# EAGLE design detector328p-au (EAGLE 7.1.0)

## Sheet 1 of 2
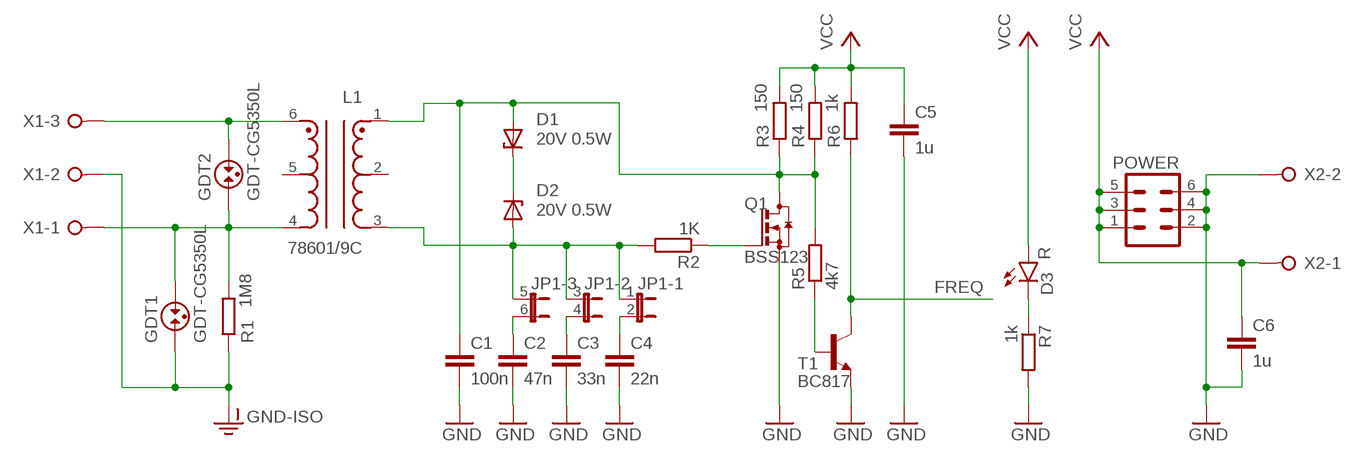
[diagram p0: schematic, sheet 1]

### Parts
C1  100n  C-EUC1206  [C1206]
C2  47n  C-EUC0805  [C0805]
C3  33n  C-EUC0805  [C0805]
C4  22n  C-EUC0805  [C0805]
C5  1u  C-EUC0603  [C0603]
C6  1u  C-EUC0603  [C0603]
D1  20V 0.5W  ZENER-DIODESOD80C  [SOD80C]
D2  20V 0.5W  ZENER-DIODESOD80C  [SOD80C]
D3  R  LED0603  [LED-0603]
GDT1  GDT-CG5350L  [CG5350L]
GDT2  GDT-CG5350L  [CG5350L]
JP1  JP3QE  [JP3Q]
L1  78601/9C  [78601/9C]
POWER  MA03-2  [MA03-2]
Q1  BSS123  [SOT23]
R1  1M8  R-EU_R0603  [R0603]
R2  1K  R-EU_R0603  [R0603]
R3  150  R-EU_R0603  [R0603]
R4  150  R-EU_R0603  [R0603]
R5  4k7  R-EU_R0603  [R0603]
R6  1k  R-EU_R0603  [R0603]
R7  1k  R-EU_R0603  [R0603]
T1  BC817  BC817-40SMD  [SOT23-BEC]
X1  W237-3E  [W237-3E]
X2  W237-02P  [W237-132]

### Nets
FREQ: R6.1 T1.C ; also sheet 2
GND: C1.2 C2.2 C3.2 C4.2 C5.2 C6.2 POWER.2 POWER.4 POWER.6 Q1.2(S) R7.2 T1.E X2.2 ; also sheet 2
GND-ISO: GDT1.1 R1.1 X1.2
N$1: D1.C D2.C
N$2: R5.1 T1.B
N$3: Q1.1(G) R2.1
N$4: C3.1 JP1.4
N$5: C4.1 JP1.2
N$6: D2.A JP1.1 JP1.3 JP1.5 L1.3 R2.2
N$7: GDT2.2 L1.6 X1.3
N$11: C2.1 JP1.6
N$14: C1.1 D1.A L1.1 Q1.3(D) R3.1 R4.1 R5.2
N$21: GDT1.2 GDT2.1 L1.4 R1.2 X1.1
N$22: D3.C R7.1
VCC: C5.1 C6.1 D3.A POWER.1 POWER.3 POWER.5 R3.2 R4.2 R6.2 X2.1 ; also sheet 2
Unconnected: L1.2 L1.5

## Sheet 2 of 2
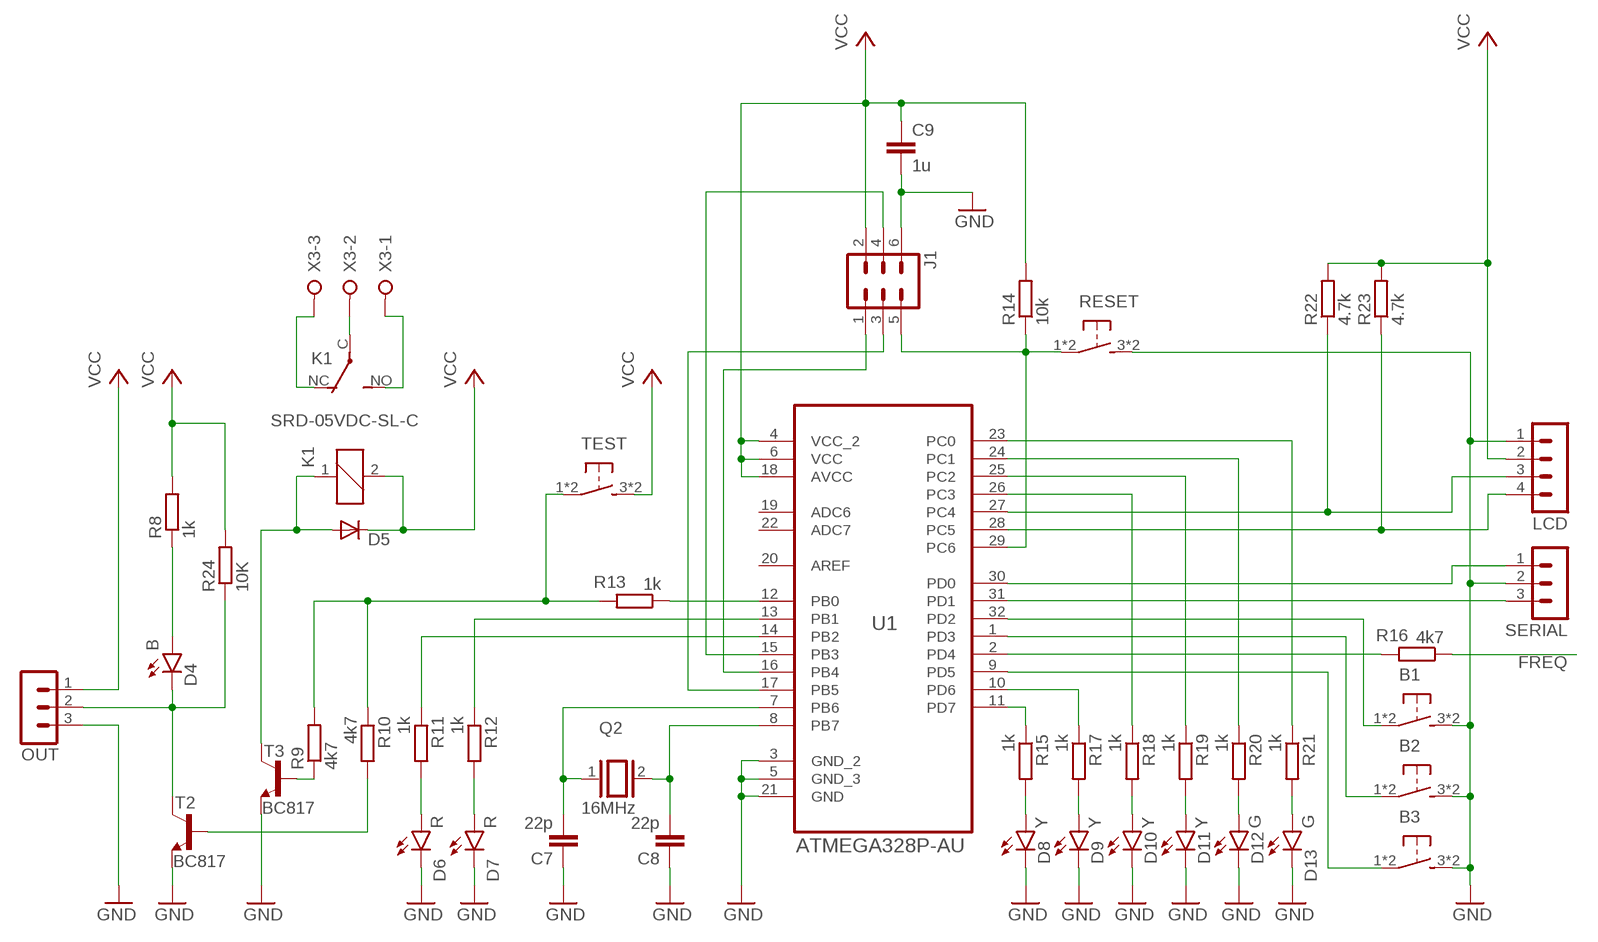
[diagram p1: schematic, sheet 2]

### Parts
B1  10-XX  [B3F-10XX]
B2  10-XX  [B3F-10XX]
B3  10-XX  [B3F-10XX]
C7  22p  C-EUC0603  [C0603]
C8  22p  C-EUC0603  [C0603]
C9  1u  C-EUC0603  [C0603]
D4  B  LED0603  [LED-0603]
D5  DIODE-SOD80C  [SOD80C]
D6  R  LED0603  [LED-0603]
D7  R  LED0603  [LED-0603]
D8  Y  LED0603  [LED-0603]
D9  Y  LED0603  [LED-0603]
D10  Y  LED0603  [LED-0603]
D11  Y  LED0603  [LED-0603]
D12  G  LED0603  [LED-0603]
D13  G  LED0603  [LED-0603]
J1  MA03-2  [MA03-2]
K1  SRD-05VDC-SL-C  [JS-M]
LCD  MA04-1  [MA04-1]
OUT  MA03-1  [MA03-1]
Q2  16MHz  XTAL/S  [QS]
R8  1k  R-EU_R0603  [R0603]
R9  4k7  R-EU_R0603  [R0603]
R10  4k7  R-EU_R0603  [R0603]
R11  1k  R-EU_R0603  [R0603]
R12  1k  R-EU_R0603  [R0603]
R13  1k  R-EU_R0603  [R0603]
R14  10k  R-EU_R0603  [R0603]
R15  1k  R-EU_R0603  [R0603]
R16  4k7  R-EU_R0603  [R0603]
R17  1k  R-EU_R0603  [R0603]
R18  1k  R-EU_R0603  [R0603]
R19  1k  R-EU_R0603  [R0603]
R20  1k  R-EU_R0603  [R0603]
R21  1k  R-EU_R0603  [R0603]
R22  4.7k  R-EU_R0603  [R0603]
R23  4.7k  R-EU_R0603  [R0603]
R24  10K  R-EU_R0603  [R0603]
RESET  10-XX  [B3F-10XX]
SERIAL  MA03-1  [MA03-1]
T2  BC817  BC817-40SMD  [SOT23-BEC]
T3  BC817  BC817-40SMD  [SOT23-BEC]
TEST  10-XX  [B3F-10XX]
U1  ATMEGA328P-AU  [QFP80P900X900X120-32N]
X3  W237-3E  [W237-3E]

### Nets
FREQ: R16.1 ; also sheet 1
GND: B1.3(S) B1.4(S) B2.3(S) B2.4(S) B3.3(S) B3.4(S) C7.1 C8.1 C9.2 D6.C D7.C D8.C D9.C D10.C D11.C D12.C D13.C J1.6 LCD.1 OUT.3 RESET.3(S) RESET.4(S) SERIAL.2 T2.E T3.E U1.3(GND_2) U1.5(GND_3) U1.21(GND) ; also sheet 1
N$8: C7.2 Q2.1 U1.7(PB6)
N$9: R16.2 U1.2(PD4)
N$10: C8.2 Q2.2 U1.8(PB7)
N$12: J1.1 U1.16(PB4)
N$13: J1.4 U1.15(PB3)
N$15: J1.3 U1.17(PB5)
N$16: D9.A R17.2
N$17: D10.A R18.2
N$18: D11.A R19.2
N$19: D12.A R20.2
N$20: R10.2 T2.B
N$23: D4.C OUT.2 R24.1 T2.C
N$24: D4.A R8.1
N$25: R17.1 U1.10(PD6)
N$26: R15.1 U1.11(PD7)
N$27: D8.A R15.2
N$28: R18.1 U1.26(PC3)
N$29: R19.1 U1.25(PC2)
N$30: J1.5 R14.1 RESET.1(P) RESET.2(P) U1.29(PC6)
N$31: R20.1 U1.24(PC1)
N$32: D13.A R21.2
N$33: R21.1 U1.23(PC0)
N$34: D7.A R12.2
N$35: D6.A R11.2
N$36: R11.1 U1.14(PB2)
N$37: R12.1 U1.13(PB1)
N$38: D5.A K1.1 T3.C
N$39: SERIAL.1 U1.30(PD0)
N$40: R9.1 T3.B
N$41: K1.NC(2:O) X3.3
N$42: K1.NO(2:S) X3.1
N$43: K1.C(2:P) X3.2
N$44: LCD.4 R23.1 U1.28(PC5)
N$45: LCD.3 R22.1 U1.27(PC4)
N$46: R13.1 U1.12(PB0)
N$47: R9.2 R10.1 R13.2 TEST.1(P) TEST.2(P)
N$48: SERIAL.3 U1.31(PD1)
N$49: B1.1(P) B1.2(P) U1.32(PD2)
N$50: B2.1(P) B2.2(P) U1.1(PD3)
N$51: B3.1(P) B3.2(P) U1.9(PD5)
VCC: C9.1 D5.C J1.2 K1.2 LCD.2 OUT.1 R8.2 R14.2 R22.2 R23.2 R24.2 TEST.3(S) TEST.4(S) U1.4(VCC_2) U1.6(VCC) U1.18(AVCC) ; also sheet 1
Unconnected: U1.19(ADC6) U1.20(AREF) U1.22(ADC7)

## Library data of the parts
B1-B3 RESET TEST = detector:10-XX: OMRON SWITCH; MPN: B3F-1000; OC_FARNELL: 176432; OC_NEWARK: 36M3542
C1-C4 C7 C8 = resistor:C-EU: CAPACITOR, European symbol
C5 C6 C9 = rcl:C-EU: CAPACITOR, European symbol
D1 D2 = diode:ZENER-DIODE: Z-Diode
D3 D4 D6-D13 = SparkFun-LED:LED: LEDs Standard schematic elements and footprints for 5mm, 3mm, 1206, and 0603 sized LEDs. 5mm - Spark Fun Electronics SKU : COM-00529 (and others)
D5 = diode:DIODE-: DIODE
GDT1 GDT2 = supressor:GDT-: GAS DISCHARGE TUBE
J1 POWER = con-lstb:MA03-2: PIN HEADER; OC_FARNELL: unknown; OC_NEWARK: unknown
JP1 = detector:JP3QE: JUMPER
K1 = detector:SRD-*-SL-C: Ultra-Miniature Power Relay
L1 = detector:78601/9C: MuRata 78601/9C
LCD = con-lstb:MA04-1: PIN HEADER; OC_FARNELL: unknown; OC_NEWARK: unknown
OUT SERIAL = con-lstb:MA03-1: PIN HEADER; OC_FARNELL: unknown; OC_NEWARK: unknown
Q1 = transistor-small-signal:BSS123: N-CHANNEL MOS FET
Q2 = special:XTAL/S: CRYSTAL
R1-R21 R24 = resistor:R-EU_: RESISTOR, European symbol
R22 R23 = rcl:R-EU_: RESISTOR, European symbol
T1-T3 = transistor-npn:BC817*: NPN Transistor
U1 = detector:ATMEGA328P-AU: 8-bit Microcontroller with In-System Programmable Flash; MPN: ATMEGA328P-AU; OC_FARNELL: 1715486; OC_NEWARK: 14R4631; PACKAGE: TQFP-32; SUPPLIER: Atmel
X1 X3 = detector:W237-3E: WAGO SREW CLAMP; OC_FARNELL: unknown; OC_NEWARK: unknown
X2 = detector:W237-02P: WAGO SREW CLAMP; OC_FARNELL: unknown; OC_NEWARK: unknown

## Board
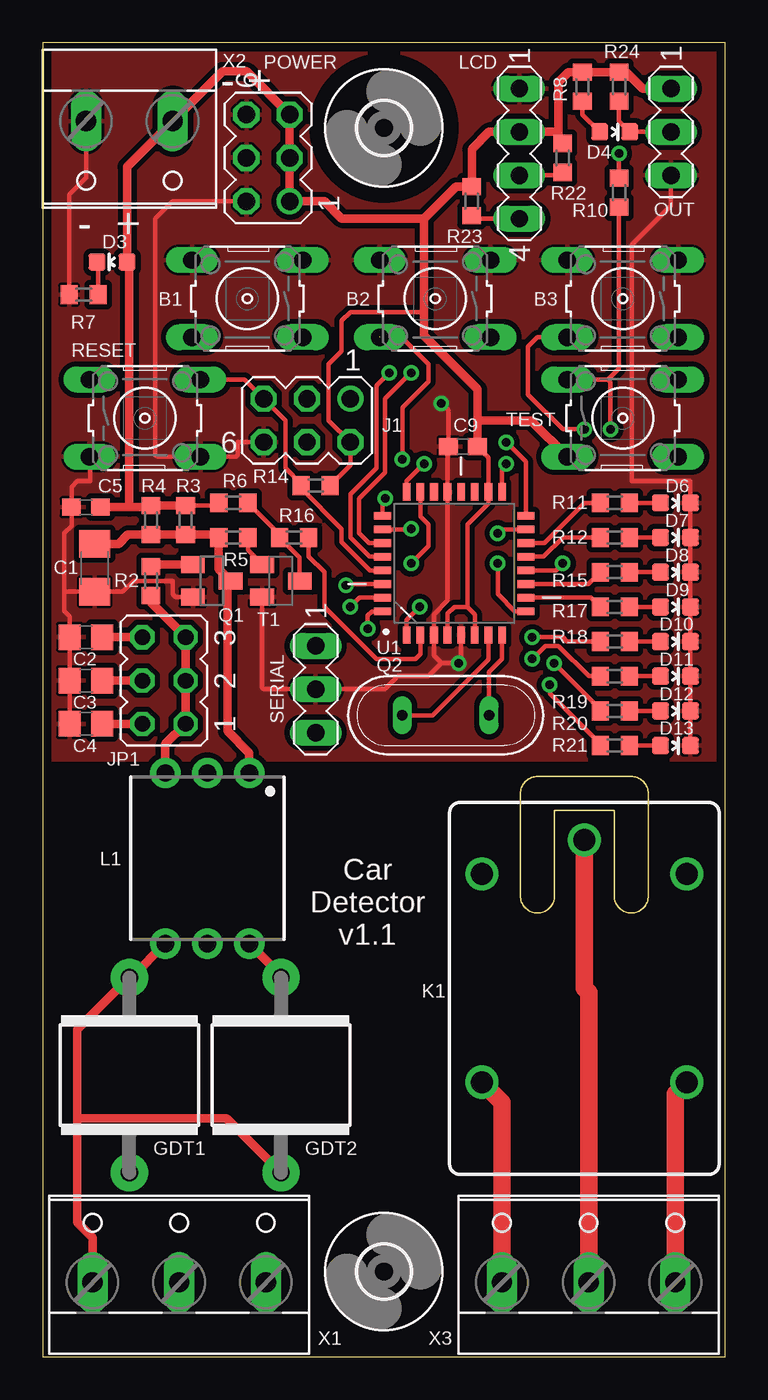
[diagram p2: board, top side]
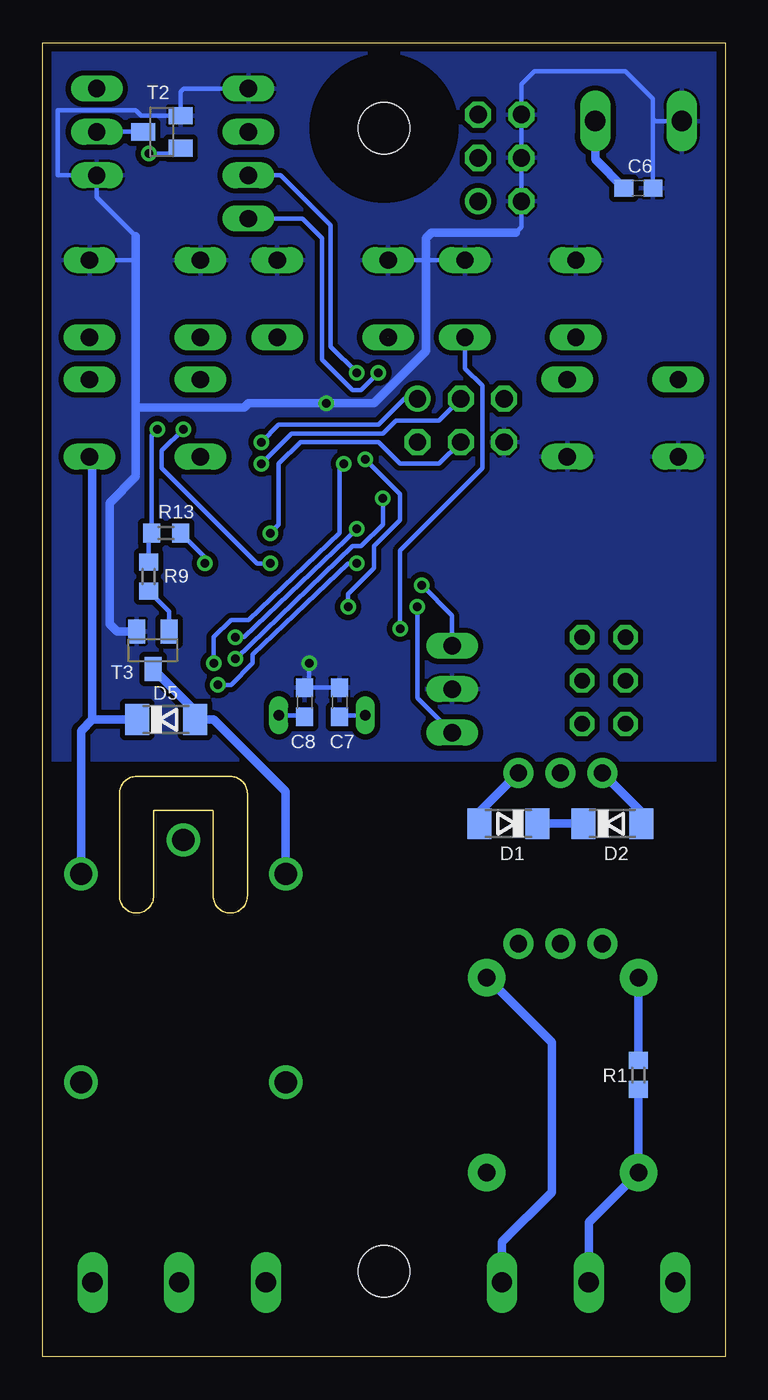
[diagram p3: board, bottom side, seen from below]

Size 40 x 77 mm. Coordinates in mm from the lower left corner, seen from the top.
Outline: 0,0 40,0 40,77 0,77 0,0
Copper layers (1*16): Top 0.035mm / dielectric 1.5mm / Bottom 0.035mm
Design rules "NYAKARUHAZ_StandardNYAK": minimum track width 6mil, minimum drill 12mil, track to track 6mil, track to pad 6mil, pad to pad 6mil, via to via 6mil, smd to smd 6mil, copper to edge 20mil, drill to drill 8mil, minimum pad ring 10mil, minimum via ring 8mil, stop-mask expansion 4mil, vias tented up to drill 0mil, thermal gap 6mil
Milling: 12 lines

### Footprints (pad centres in the part's own frame; a part is rotated, then mirrored left to right if it is on the bottom)
B3F-10XX = drill 1.016 long: 1 -3.251,2.261; 2 3.251,2.261; 3 -3.251,-2.261; 4 3.251,-2.261
C1206 = smd 1.6 x 1.8: 1 -1.4,0; 2 1.4,0
C0805 = smd 1.3 x 1.5: 1 -0.95,0; 2 0.95,0
C0603 = smd 1.1 x 1: 1 -0.85,0; 2 0.85,0
SOD80C = smd 1.4 x 1.8: A 1.7,0; C -1.7,0
LED-0603 = smd 1 x 1: A 0,-0.877; C 0,0.877
CG5350L = drill 1.016 pad 2.184: 1 -5.715,0; 2 5.715,0
MA03-2 = drill 1.016: 1 -2.54,-1.27 | drill 1.016 octagon: 2 -2.54,1.27; 3 0,-1.27; 4 0,1.27; 5 2.54,-1.27; 6 2.54,1.27
JP3Q = drill 0.914 octagon: 1 -2.54,-1.27; 2 -2.54,1.27; 3 0,-1.27; 4 0,1.27; 5 2.54,-1.27; 6 2.54,1.27
JS-M = drill 1.3: 1 6.7,6; 2 6.7,-6; C 8.7,0; NC -5.5,-6; NO -5.5,6
78601/9C = drill 1 pad 1.778: 1 -5,2.46; 2 -5,0; 3 -5,-2.46; 4 5,-2.46; 5 5,0; 6 5,2.46
MA04-1 = drill 1.016 long: 1 -3.81,0; 2 -1.27,0; 3 1.27,0; 4 3.81,0
MA03-1 = drill 1.016 long: 1 -2.54,0; 2 0,0; 3 2.54,0
SOT23 = smd 1 x 1.4: 1 -0.95,-1.1; 2 0.95,-1.1; 3 0,1.1
QS = drill 0.61 long: 1 -2.54,0; 2 2.54,0
R0603 = smd 1 x 1.1: 1 -0.85,0; 2 0.85,0
SOT23-BEC = smd 1 x 1.4: B -0.95,-1.1; C 0,1.1; E 0.95,-1.1
QFP80P900X900X120-32N = smd 1 x 0.45: 1 -4.2,2.8; 2 -4.2,2; 3 -4.2,1.2; 4 -4.2,0.4; 5 -4.2,-0.4; 6 -4.2,-1.2; 7 -4.2,-2; 8 -4.2,-2.8; 17 4.2,-2.8; 18 4.2,-2; 19 4.2,-1.2; 20 4.2,-0.4; 21 4.2,0.4; 22 4.2,1.2; 23 4.2,2; 24 4.2,2.8 | smd 0.45 x 1: 9 -2.8,-4.2; 10 -2,-4.2; 11 -1.2,-4.2; 12 -0.4,-4.2; 13 0.4,-4.2; 14 1.2,-4.2; 15 2,-4.2; 16 2.8,-4.2; 25 2.8,4.2; 26 2,4.2; 27 1.2,4.2; 28 0.4,4.2; 29 -0.4,4.2; 30 -1.2,4.2; 31 -2,4.2; 32 -2.8,4.2
3,0 = hole 3: 0,0
W237-3E = drill 1.194 long: 1 -5.08,-0.635; 2 0,-0.635; 3 5.08,-0.635
W237-132 = drill 1.194 long: 1 -2.54,-0.635; 2 2.54,-0.635

### Placement (x,y rotation side)
B1  12,62 180 top
B2  23,62 180 top
B3  34,62 180 top
C1  3.05,46.23 270 top
C2  2.54,42.16 180 top
C3  2.54,39.62 180 top
C4  2.54,37.08 180 top
C5  2.54,49.78 180 top
C6  5.08,68.47 0 bottom
C7  22.61,38.35 270 bottom
C8  24.64,38.35 270 bottom
C9  24.64,53.34 180 top
D1  12.7,31.24 180 bottom
D2  6.6,31.24 0 bottom
D3  4.06,64.15 90 top
D4  33.53,71.77 270 top
D5  32.77,37.34 0 bottom
D6  37.08,50.04 270 top
D7  37.08,48.01 270 top
D8  37.08,45.97 270 top
D9  37.08,43.94 270 top
D10  37.08,41.91 270 top
D11  37.08,39.88 270 top
D12  37.08,37.85 270 top
D13  37.08,35.81 270 top
GDT1  5.08,16.51 90 top
GDT2  13.97,16.51 90 top
J1  15.49,54.86 180 top
JP1  7.11,39.62 90 top
K1  31.75,21.59 90 top
L1  9.65,29.21 270 top
LCD  27.94,70.5 270 top
OUT  36.83,71.77 270 top
POWER  13.21,70.25 90 top
Q1  9.91,45.47 270 top
Q2  23.62,37.59 0 top
R1  5.08,16.51 90 bottom
R2  6.35,45.47 270 top
R3  8.38,49.02 90 top
R4  6.35,49.02 90 top
R5  11.18,48.01 180 top
R6  11.18,50.04 180 top
R7  2.4,62.23 180 top
R8  31.64,74.42 90 top
R9  33.78,45.72 90 bottom
R10  33.78,68.21 90 top
R11  33.53,50.04 0 top
R12  33.53,48.01 0 top
R13  32.77,48.26 180 bottom
R14  16,51.05 0 top
R15  33.53,45.97 0 top
R16  14.73,48.01 0 top
R17  33.53,43.94 0 top
R18  33.53,41.91 0 top
R19  33.53,39.88 0 top
R20  33.53,37.85 0 top
R21  33.53,35.81 0 top
R22  30.48,70.25 90 top
R23  25.15,67.71 90 top
R24  33.78,74.42 90 top
RESET  6,55 0 top
SERIAL  16,39.12 270 top
T1  13.97,45.47 270 top
T2  33.02,71.77 90 bottom
T3  33.53,41.4 180 bottom
TEST  34,55 0 top
U1  24.13,46.48 90 top
U$1  [3,0]  20,5 0 top
U$2  [3,0]  20,72 0 top
X1  8,5 0 top
X2  5.08,71.77 180 top
X3  32,5 0 top

### Tracks (layer width: path | path; a pad name or v marks a point on that pad's centre or on a via)
FREQ
  Top 0.254: R6.1 13.88,48.18 R16.1 15.07,46.82 T1.C
GND  (via drill 0.5)
  Top 0.254: C4.2 C3.2 C2.2 1.59,43.37 1.27,43.69 1.27,44.7 | Q1.2 7.81,44.52 7.62,44.7 7.62,45.47 5.33,45.47 4.7,44.83 C1.2 1.39,44.83 1.27,44.7 | J1.6 11.43,53.59 11.43,52.83 11.34,52.74 RESET.4 6.7,52.74 6.6,52.83 6.6,66.69 7.62,67.71 POWER.2 | 23.37,40.64 22.93,41.08 U1.3 22.93,43.5 23.73,44.3 U1.21 23.73,53.28 C9.2 | 23.37,40.64 v24.38,40.64 24.53,40.79 U1.5 | C9.2 23.72,53.02 | OUT.3 36.83,67.45 34.54,65.17 34.54,51.31 37.96,51.31 D6.C D7.C D8.C D9.C D10.C D11.C D12.C D13.C | RESET.3 2.79,52.69 2.79,51.31 2.03,51.31 1.69,50.97 C5.2 1.69,48.68 1.27,48.26 1.27,44.7 | v23.37,55.88 23.79,55.46 C9.2 | 23.37,40.64 22.61,39.88 20.83,39.88 20.07,39.12 SERIAL.2 12.95,39.12 12.87,39.2 T1.E | X2.2 2.54,69.09 1.55,68.1 R7.2
  Bottom 0.254: C6.2 4.23,72.53 | 4.23,72.53 4.23,73.71 5.84,75.33 11.18,75.33 11.94,74.56 POWER.6 POWER.4 POWER.2 11.94,66.18 12.26,65.86 | X2.2 4.1,72.41 4.23,72.53 | C7.1 C8.1 24.38,39.71 v24.38,40.64 | LCD.1 31.75,74.31 31.92,74.14 T2.E 34.22,72.72 34.54,73.04 39.12,73.04 39.12,69.23 OUT.3 36.83,67.96 34.54,65.67 | B1.3 17.53,64.26 B2.4 | B3.3 34.54,64.26
  Bottom 0.508: T3.E 35.64,42.5 36.07,42.93 36.07,50.04 34.54,51.56 34.54,55.63 | 34.54,55.63 34.54,64.26 34.54,65.67 | 34.54,55.63 28.19,55.63 27.94,55.88 v23.37,55.88 20.57,55.88 17.53,58.93 17.53,64.26 17.53,65.53 17.2,65.86 12.26,65.86
  pour Bottom (isolate 0.305): 0,77 40,77 40,35 0,35
  pour Top (isolate 0.305): 40,77 0,77 0,35 40,35
GND-ISO
  Bottom 0.508: R1.1 GDT1.1 8,7.88 X1.2
N$1
  Bottom 0.508: D2.C D1.C
N$2
  Top 0.254: R5.1 12.03,47.26 T1.B
N$3
  Top 0.254: 6.45,46.42 R2.1
  Top 0.508: Q1.1 6.45,46.42
N$4
  Top 0.508: JP1.4 C3.1
N$5
  Top 0.508: JP1.2 C4.1
N$6
  Top 0.254: R2.2 6.35,44.2
  Top 0.508: 6.35,44.2 JP1.5 JP1.3 JP1.1 7.19,35.89 L1.3
  Bottom 0.508: D2.A 4.9,31.92 L1.3
N$7
  Top 0.254: GDT2.2 13.97,22.35
  Top 0.508: 13.97,22.35 L1.6
  Bottom 0.508: X1.3 13.08,6.73 10.16,9.65 10.16,18.41 GDT2.2
N$8
  Top 0.254: U1.7 26.13,40.86 22.86,37.59 Q2.1
  Bottom 0.254: C7.2 22.52,37.59 Q2.1
N$9
  Top 0.254: U1.2 22.13,41.18 21.84,40.89 19.56,40.89 16.51,43.94 16.51,45.97 15.58,46.9 R16.2
N$10
  Top 0.254: U1.8 26.93,40.9 26.16,40.13 Q2.2
  Bottom 0.254: C8.2 24.73,37.59 Q2.2
N$11
  Top 0.508: JP1.6 C2.1
N$12  (via drill 0.5)
  Top 0.254: U1.16 28.33,52.44 v27.18,53.59
  Bottom 0.254: v27.18,53.59 26.16,54.61 20.32,54.61 18.8,56.13 J1.1
N$13  (via drill 0.5)
  Top 0.254: U1.15 26.89,48.48 v26.67,48.26
  Bottom 0.254: J1.4 16.76,52.32 19.05,52.32 20.32,53.59 24.89,53.59 26.16,52.32 26.16,48.77 v26.67,48.26
N$14
  Top 0.254: 10.83,45.29 Q1.3 10.92,45.55
  Top 0.508: L1.1 12.11,35.39 10.83,36.66 10.83,45.29 | Q1.3 10.33,46.15 R5.2 10.16,48.17 R3.1 R4.1 4.99,48.17 4.45,47.63 C1.1
  Bottom 0.508: D1.A 14.4,31.92 L1.1
N$15  (via drill 0.5)
  Top 0.254: U1.17 26.93,52.08 v27.18,52.32
  Bottom 0.254: v27.18,52.32 25.4,54.1 20.07,54.1 19.3,54.86 16.76,54.86 J1.3
N$16
  Top 0.254: R17.2 D9.A
N$17
  Top 0.254: R18.2 D10.A
N$18
  Top 0.254: R19.2 D11.A
N$19
  Top 0.254: R20.2 D12.A
N$20  (via drill 0.5)
  Top 0.254: R10.2 v33.78,70.5
  Bottom 0.254: v33.78,70.5 32.24,70.5 T2.B
N$21
  Top 0.254: GDT1.2 5.21,22.23
  Top 0.508: 5.21,22.23 L1.4 | X1.1 2.92,6.99 2.03,7.87 2.03,13.97 | 2.03,13.97 2.03,19.18 GDT1.2 | GDT2.1 10.79,13.97 2.03,13.97
  Bottom 0.508: R1.2 GDT1.2
N$22
  Top 0.254: R7.1 3.25,64.09 D3.C
N$23
  Top 0.254: OUT.2 D4.C 33.78,72.39 R24.1
  Bottom 0.254: T2.C OUT.2
N$24
  Top 0.254: 32.6,71.82 D4.A 31.64,72.78 R8.1
N$25
  Top 0.254: U1.10 32.14,44.48 R17.1
N$26
  Top 0.254: U1.11 31.99,45.28 R15.1
N$27
  Top 0.254: R15.2 D8.A
N$28  (via drill 0.5)
  Top 0.254: v28.7,42.16 30.48,42.16 30.73,41.91 R18.1 | U1.26 21.56,48.48 v21.59,48.51
  Bottom 0.254: v28.7,42.16 28.19,42.16 v21.59,48.51
N$29  (via drill 0.5)
  Top 0.254: v28.7,40.89 29.46,41.66 30.23,41.66 32,39.88 R19.1 | U1.25 19.93,50.16 v20.07,50.29
  Bottom 0.254: v20.07,50.29 20.07,48.77 21.34,47.5 21.84,47.5 v28.7,40.89
N$30
  Top 0.254: RESET.2 11.83,57.26 J1.5 14.22,54.86 14.22,52.07 15.15,51.14 R14.1 15.15,50.89 17.53,48.51 17.53,47.75 19.2,46.08 U1.29
N$31  (via drill 0.5)
  Top 0.254: U1.24 21.34,51.31 v22.35,52.32 | R20.1 32.68,37.93 v29.97,40.64
  Bottom 0.254: v22.35,52.32 22.61,52.07 22.61,48.26 27.94,43.18 28.96,43.18 29.97,42.16 v29.97,40.64
N$32
  Top 0.254: R21.2 D13.A
N$33  (via drill 0.5)
  Top 0.254: v21.59,46.48 22.61,47.5 22.61,48.77 22.13,49.24 U1.23 | R21.1 32.68,35.9 29.72,38.86 v29.72,39.37
  Bottom 0.254: v29.72,39.37 28.96,39.37 27.69,40.64 27.69,41.15 22.1,46.48 v21.59,46.48
N$34
  Top 0.254: R12.2 D7.A
N$35
  Top 0.254: R11.2 D6.A
N$36
  Top 0.254: R11.1 31.75,50.04 29.39,47.68 U1.14
N$37
  Top 0.254: R12.1 30.48,48.01 29.36,46.88 U1.13
N$38
  Bottom 0.508: K1.1 25.75,33.12 29.97,37.34 D5.A 31.07,37.84 T3.C
N$39  (via drill 0.5)
  Top 0.254: U1.30 17.85,45.28 v17.78,45.21
  Bottom 0.254: SERIAL.1 16,43.43 v17.78,45.21
N$40
  Bottom 0.254: T3.B 32.58,43.67 R9.1
N$41
  Top 1.016: X3.3 37.08,15.42 K1.NC
N$42
  Top 1.016: K1.NO 26.92,14.92 X3.1
N$43
  Top 1.016: K1.C 31.75,21.59 32,21.34 X3.2
N$44  (via drill 0.5)
  Top 0.254: R23.1 25.31,66.69 LCD.4 | U1.28 19.16,46.88 18.03,48.01 18.03,50.55 19.56,52.07 19.56,56.9 v20.32,57.66
  Bottom 0.254: v20.32,57.66 21.34,56.64 21.84,56.64 23.62,58.42 23.62,65.53 24.78,66.69 LCD.4
N$45  (via drill 0.5)
  Top 0.254: R22.1 30.31,69.23 LCD.3 | U1.27 19.12,47.68 18.54,48.26 18.54,50.29 20.07,51.82 20.07,56.13 v21.59,57.66
  Bottom 0.254: v21.59,57.66 23.11,59.18 23.11,66.29 26.05,69.23 LCD.3
N$46  (via drill 0.5)
  Top 0.254: U1.12 30.08,46.08 v30.48,46.48
  Bottom 0.254: R13.1 30.48,46.82 v30.48,46.48
N$47  (via drill 0.5)
  Top 0.254: 33.78,67.29 R10.1 33.78,57.91 33.13,57.26 | TEST.1 33.13,57.26 | v33.27,54.36 33.27,57.12 33.13,57.26
  Bottom 0.254: R9.2 33.78,47.84 R13.2 33.62,54.01 v33.27,54.36
N$48  (via drill 0.5)
  Top 0.254: U1.31 18.57,44.48 v18.03,43.94
  Bottom 0.254: v18.03,43.94 18.03,38.61 SERIAL.3
N$49  (via drill 0.5)
  Top 0.254: U1.32 19.3,43.68 19.05,43.43 v19.05,42.67
  Bottom 0.254: v19.05,42.67 19.05,47.24 14.22,52.07 14.22,56.9 15.24,57.91 15.24,59.73 B1.1
N$50  (via drill 0.5)  (1 unrouted)
  Top 0.254: U1.1 21.33,43.17 v22.1,43.94 | 19.76,59.74 21.03,59.74 22.61,58.17 22.61,57.15 21.08,55.63 v21.08,52.58
  Bottom 0.254: v22.1,43.94 22.1,44.7 20.57,46.23 20.57,47.5 19.05,49.02 19.05,50.55 v21.08,52.58
N$51  (via drill 0.5)
  Top 0.254: U1.9 27.69,43.68 26.67,44.7 v26.67,46.48 | v31.75,54.36 30.48,54.36 28.45,56.39 28.45,59.18 29,59.74 B3.2
  Bottom 0.254: v26.67,46.48 27.43,46.48 33.02,52.07 33.02,53.09 v31.75,54.36
VCC
  Top 0.254: C9.1 26.13,52.7 U1.18 26.13,50.01 24.89,48.77 24.89,43.94 | U1.4 23.73,43.54 24.13,43.94 24.89,43.94 | R3.2 10.16,49.87 R6.2 | R14.2 18.03,52.24 J1.2 16.76,54.86 16.76,58.17 17.53,58.93 17.53,60.71 18.03,61.21 22.35,61.21 | 24.89,43.94 25.33,43.5 U1.6
  Top 0.508: 5.08,49.78 6.01,49.78 R4.2 R3.2 | 5.08,49.78 C5.1 | 22.35,66.69 24.22,68.56 R23.2 25.15,70.75 26.16,71.77 LCD.2 30.08,71.77 30.23,71.63 | 22.35,66.69 22.35,61.21 22.35,59.83 25.49,56.7 25.49,54.86 | 22.35,66.69 17.53,66.69 16.51,67.71 POWER.1 POWER.3 POWER.5 11.94,75.33 10.54,75.33 X2.1 4.94,69.73 D3.A 5.08,64.01 5.08,49.78 | 25.49,54.86 C9.1 | TEST.3 28.62,54.86 25.49,54.86 | R22.2 30.23,71.1 30.23,71.63 | 30.23,71.63 30.23,74.68 30.82,75.27 R8.2 R24.2 34.2,75.27 35.16,74.31 OUT.1
  Bottom 0.508: C6.1 7.62,70.16 X2.1 | K1.2 37.75,36.67 37.08,37.34 | D5.C 37.08,37.34 | 37.08,37.34 37.08,52.57 TEST.4

### Text on the board
tPlace: - + | - + | Car / Detector / v1.1